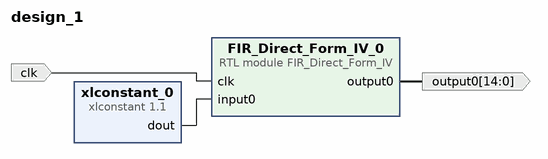
[diagram p0: block diagram of the top level]
# Vivado block design design_1, xc7z020clg400-1, Vivado 2021.2
create_bd_design design_1

create_bd_port -dir I -type clk clk
create_bd_port -dir O -from 14 -to 0 output0

create_bd_cell -type ip -vlnv xilinx.com:ip:xlconstant:1.1 xlconstant_0
set_property -dict {CONFIG.CONST_VAL 7373 CONFIG.CONST_WIDTH 14} [get_bd_cells xlconstant_0]
create_bd_cell -type module -reference FIR_Direct_Form_IV FIR_Direct_Form_IV_0

# ---- connections ----

connect_bd_net [get_bd_pins FIR_Direct_Form_IV_0/output0] [get_bd_ports output0]
connect_bd_net -net clk_0_1 [get_bd_ports clk] [get_bd_pins FIR_Direct_Form_IV_0/clk]
connect_bd_net [get_bd_pins xlconstant_0/dout] [get_bd_pins FIR_Direct_Form_IV_0/input0]

validate_bd_design
save_bd_design
